# EAGLE design header2313 (EAGLE 5.04)
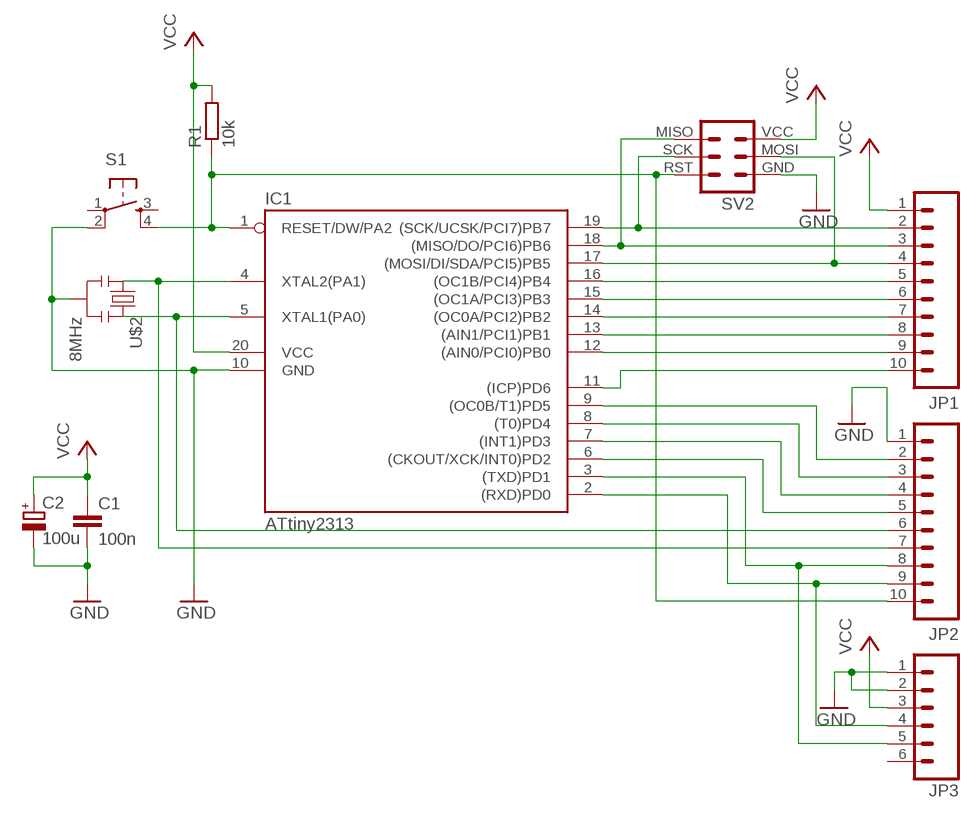
[diagram p0: schematic, sheet 1]

## Parts
C1  100n  C-EU025-025X050  [C025-025X050]
C2  100u  CPOL-EUE2.5-5  [E2,5-5]
IC1  ATtiny2313  ATTINY2313-20P  [DIL20]
JP1  M100.1  [1X10]
JP2  M100.1  [1X10]
JP3  M06SIP  [1X06]
R1  10k  R-EU_0207/5V  [0207/5V]
S1  TAC_SWITCHPTH  [TACTILE-PTH]
SV2  MA03-2  [MA03-2]
U$2  8MHz  RESONATORPTH  [RESONATOR-PTH]

## Nets
GND: C1.2 C2.- IC1.10(GND) JP2.1 JP3.1 JP3.2 S1.2 SV2.GND U$2.2
N$2: IC1.4(XTAL2(PA1)) JP2.7 U$2.1
N$3: IC1.5(XTAL1(PA0)) JP2.6 U$2.3
N$4: IC1.1(RESET/DW/PA2) JP2.10 R1.1 S1.4 SV2.RST
N$5: IC1.19((SCK/UCSK/PCI7)PB7) JP1.2 SV2.SCK
N$6: IC1.18((MISO/DO/PCI6)PB6) JP1.3 SV2.MISO
N$7: IC1.17((MOSI/DI/SDA/PCI5)PB5) JP1.4 SV2.MOSI
N$8: IC1.16((OC1B/PCI4)PB4) JP1.5
N$9: IC1.15((OC1A/PCI3)PB3) JP1.6
N$10: IC1.14((OC0A/PCI2)PB2) JP1.7
N$11: IC1.13((AIN1/PCI1)PB1) JP1.8
N$12: IC1.12((AIN0/PCI0)PB0) JP1.9
N$13: IC1.11((ICP)PD6) JP1.10
N$14: IC1.9((OC0B/T1)PD5) JP2.2
N$15: IC1.8((T0)PD4) JP2.3
N$16: IC1.7((INT1)PD3) JP2.4
N$17: IC1.6((CKOUT/XCK/INT0)PD2) JP2.5
N$18: IC1.3((TXD)PD1) JP2.8 JP3.5
RX: IC1.2((RXD)PD0) JP2.9 JP3.4
VCC: C1.1 C2.+ IC1.20(VCC) JP1.1 JP3.3 R1.2 SV2.VCC
Unconnected: JP3.6 S1.1 S1.3

## Library data of the parts
C1 = rcl:C-EU: CAPACITOR, European symbol
C2 = rcl:CPOL-EU: POLARIZED CAPACITOR, European symbol
IC1 = avr:ATTINY2313: MICROCONTROLLER 2 Kbytes FLASH 128 bytes SRAM 128 bytes EEPROM USART USI
JP1 JP2 = SparkFun:M10: Header 10 Standard 10-pin 0.1" header. Use with straight break away headers (SKU : PRT-00116), right angle break away headers (PRT-00553), swiss pins (PRT-00743), machine pins (PRT-00117), and female headers (PRT-00115).
JP3 = SparkFun:M06: Header 6 Standard 6-pin 0.1" header. Use with straight break away headers (SKU : PRT-00116), right angle break away headers (PRT-00553), swiss pins (PRT-00743), machine pins (PRT-00117), and female headers (PRT-00115). Molex polarized connector foot print use with SKU : PRT-08094 with associated crimp pins and housings.
R1 = rcl:R-EU_: RESISTOR, European symbol
S1 = SparkFun:TAC_SWITCH: Momentary Switch Button commonly used for reset or general input. Spark Fun Electronics SKU : COM-00097
SV2 = alex:MA03-2: PIN HEADER
U$2 = SparkFun:RESONATOR: Resonator Small SMD resonator. This is the itty bitty 10/20MHz resonators with built in caps. CSTCE10M0G55 and CSTCE20M0V53. Footprint has been reviewed closely but hasn't been tested yet.

## Board
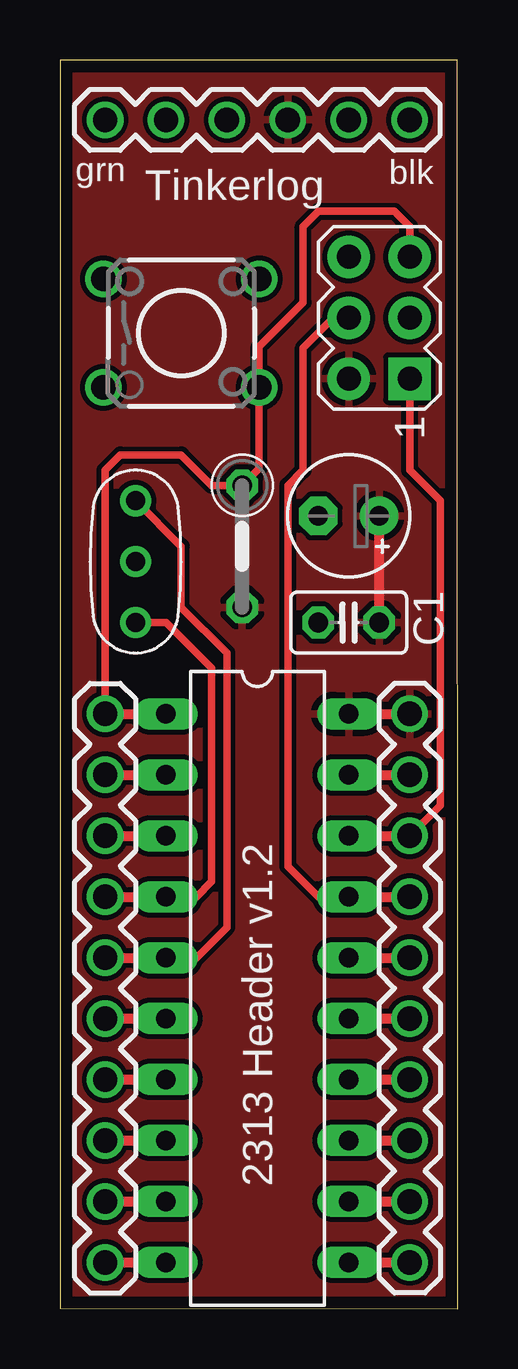
[diagram p1: board, top side]
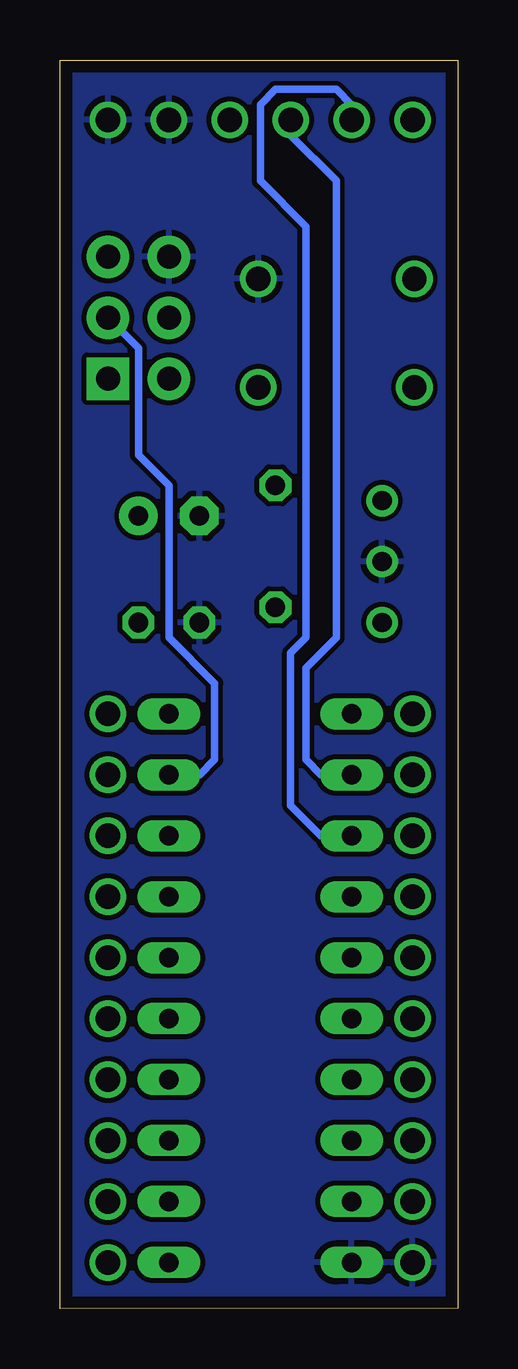
[diagram p2: board, bottom side, seen from below]

Size 16.59 x 52.04 mm. Coordinates in mm from the lower left corner, seen from the top.
Outline: 0.01,0 16.59,0 16.58,52.04 0,52.04 0.01,0
Copper layers (1*16): Top 0.035mm / dielectric 1.5mm / Bottom 0.035mm
Design rules "default *": minimum track width 10mil, minimum drill 24mil, track to track 8mil, track to pad 8mil, pad to pad 8mil, via to via 8mil, smd to smd 8mil, copper to edge 20mil, drill to drill 8mil, minimum pad ring 10mil, minimum via ring 8mil, stop-mask expansion 4mil, vias tented up to drill 0mil, thermal gap 10mil

### Footprints (pad centres in the part's own frame; a part is rotated, then mirrored left to right if it is on the bottom)
C025-025X050 = drill 0.813 octagon: 1 -1.27,0; 2 1.27,0
E2,5-5 = drill 0.813 pad 1.6 round: + -1.27,0 | drill 0.813 pad 1.6 octagon: - 1.27,0
DIL20 = drill 0.813 long: 1 -11.43,-3.81; 2 -8.89,-3.81; 3 -6.35,-3.81; 4 -3.81,-3.81; 5 -1.27,-3.81; 6 1.27,-3.81; 7 3.81,-3.81; 8 6.35,-3.81; 9 8.89,-3.81; 10 11.43,-3.81; 11 11.43,3.81; 12 8.89,3.81; 13 6.35,3.81; 14 3.81,3.81; 15 1.27,3.81; 16 -1.27,3.81; 17 -3.81,3.81; 18 -6.35,3.81; 19 -8.89,3.81; 20 -11.43,3.81
1X10 = drill 1.016 round: 1 0,0; 2 2.54,0; 3 5.08,0; 4 7.62,0; 5 10.16,0; 6 12.7,0; 7 15.24,0; 8 17.78,0; 9 20.32,0; 10 22.86,0
1X06 = drill 1.016 round: 1 0,0; 2 2.54,0; 3 5.08,0; 4 7.62,0; 5 10.16,0; 6 12.7,0
0207/5V = drill 0.813 octagon: 1 -2.54,0; 2 2.54,0
TACTILE-PTH = drill 1.016 round: 1 -3.251,2.261; 2 3.251,2.261; 3 -3.251,-2.261; 4 3.251,-2.261
MA03-2 = drill 1 pad 1.778 round: GND 2.54,1.27; MOSI 0,1.27; RST 2.54,-1.27; SCK 0,-1.27; VCC -2.54,1.27 | drill 1 pad 1.778 square: MISO -2.54,-1.27
RESONATOR-PTH = drill 0.8 round: 1 -2.54,0; 2 0,0; 3 2.54,0

### Placement (x,y rotation side)
C1  12.05,28.6 180 top
C2  12.05,33.04 180 top
IC1  8.24,13.36 270 top
JP1  14.59,24.79 270 top
JP2  1.89,1.93 90 top
JP3  14.59,49.55 180 top
R1  7.6,31.77 270 top
S1  5.06,40.66 0 top
SV2  13.32,41.3 90 top
U$2  3.16,31.14 90 top

### Tracks (layer width: path | path; a pad name or v marks a point on that pad's centre or on a via)
GND
  Top 0.406: JP2.1 IC1.10
  pour Bottom: -0.02,52.09 -0.02,0.02 16.49,0.02 16.49,52.09
N$2
  Top 0.305: U$2.1 4.43,28.6 6.33,26.69 6.33,17.8 5.7,17.17 IC1.4
  Top 0.406: JP2.7 IC1.4
N$3
  Top 0.305: U$2.3 5.06,31.77 5.06,29.23 6.97,27.33 6.97,15.9 5.7,14.63 IC1.5
  Top 0.406: JP2.6 IC1.5
N$4
  Top 0.305: SV2.RST 14.59,45.11 13.95,45.74 10.78,45.74 10.14,45.11 10.14,41.93 8.31,40.1 S1.4 8.31,35.02 R1.1 6.33,34.31 5.06,35.58 2.52,35.58 1.89,34.95 JP2.10
  Top 0.406: JP2.10 IC1.1
N$5
  Top 0.406: IC1.19 JP1.2
  Bottom 0.305: SV2.SCK 13.32,40.03 13.32,35.58 12.05,34.31 12.05,27.96 10.14,26.06 10.14,22.88 10.78,22.25 IC1.19
N$6
  Top 0.305: SV2.MISO 14.59,34.95 15.86,33.68 15.86,20.98 JP1.3
  Top 0.406: IC1.18 JP1.3
N$7
  Top 0.305: SV2.MOSI 11.41,41.3 10.14,40.03 10.14,34.95 9.51,34.31 9.51,18.44 10.78,17.17 IC1.17
  Top 0.406: IC1.17 JP1.4
N$8
  Top 0.406: IC1.16 JP1.5
N$9
  Top 0.406: IC1.15 JP1.6
N$10
  Top 0.406: IC1.14 JP1.7
N$11
  Top 0.406: IC1.13 JP1.8
N$12
  Top 0.406: IC1.12 JP1.9
N$13
  Top 0.406: IC1.11 JP1.10
N$14
  Top 0.406: JP2.2 IC1.9
N$15
  Top 0.406: JP2.3 IC1.8
N$16
  Top 0.406: JP2.4 IC1.7
N$17
  Top 0.406: JP2.5 IC1.6
N$18
  Top 0.406: JP2.8 IC1.3
  Bottom 0.305: JP3.5 4.43,50.19 5.06,50.82 7.6,50.82 8.24,50.19 8.24,47.01 6.33,45.11 6.33,27.96 6.97,27.33 6.97,20.98 5.7,19.71 IC1.3
RX
  Top 0.406: JP2.9 IC1.2
  Bottom 0.305: JP3.4 6.97,48.92 5.06,47.01 5.06,27.96 6.33,26.69 6.33,22.88 5.7,22.25 IC1.2
VCC
  Top 0.406: IC1.20 JP1.1 | C1.1 C2.+
  pour Top: -0.02,52.09 -0.02,0.02 16.49,0.02 16.49,52.09

### Text on the board
tPlace: grn | blk | Tinkerlog | 2313 Header v1.2